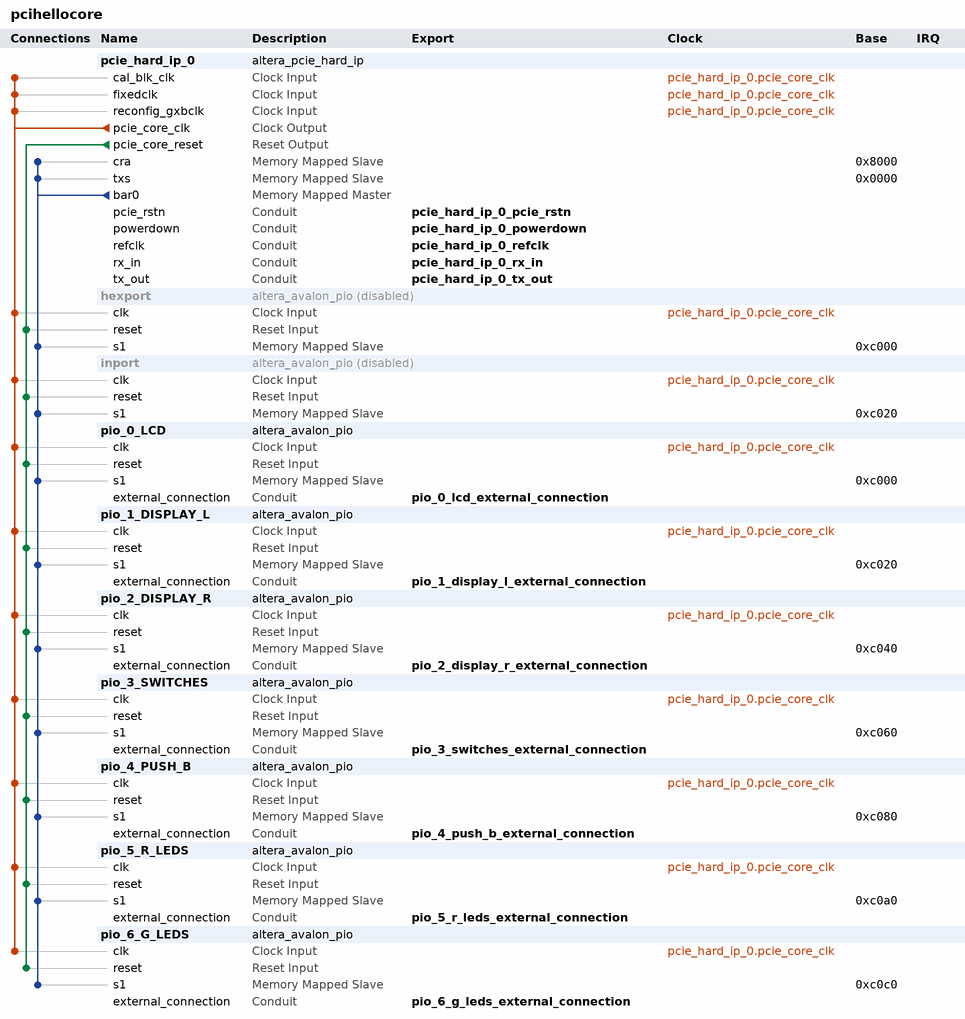
[diagram p0: system contents]
# Platform Designer (Qsys) system pcihellocore, Cyclone IV GX EP4CGX150DF31C7
# Parameters at their usual value, and those the tool derives, are not listed.
package require -exact qsys 17.1
create_system pcihellocore
set_project_property DEVICE_FAMILY {Cyclone IV GX}
set_project_property DEVICE EP4CGX150DF31C7

add_instance pcie_hard_ip_0 altera_pcie_hard_ip 17.1
set_instance_parameter_value pcie_hard_ip_0 {BAR Type} {32 bit Non-Prefetchable,Not used,Not used,Not used,Not used,Not used}
set_instance_parameter_value pcie_hard_ip_0 CB_A2P_ADDR_MAP_PASS_THRU_BITS 15
set_instance_parameter_value pcie_hard_ip_0 CG_ENABLE_A2P_INTERRUPT 0
set_instance_parameter_value pcie_hard_ip_0 CG_NO_CPL_REORDERING 0
set_instance_parameter_value pcie_hard_ip_0 {PCIe Address 31:0} 0x00000000,0x00000000,0x00000000,0x00000000,0x00000000,0x00000000,0x00000000,0x00000000,0x00000000,0x00000000,0x00000000,0x00000000,0x00000000,0x00000000,0x00000000,0x00000000
set_instance_parameter_value pcie_hard_ip_0 {PCIe Address 63:32} 0x00000000,0x00000000,0x00000000,0x00000000,0x00000000,0x00000000,0x00000000,0x00000000,0x00000000,0x00000000,0x00000000,0x00000000,0x00000000,0x00000000,0x00000000,0x00000000
set_instance_parameter_value pcie_hard_ip_0 class_code 0
set_instance_parameter_value pcie_hard_ip_0 device_id 4
set_instance_parameter_value pcie_hard_ip_0 my_advanced_errors false
set_instance_parameter_value pcie_hard_ip_0 my_enable_ecrc_check false
set_instance_parameter_value pcie_hard_ip_0 my_enable_ecrc_gen false
set_instance_parameter_value pcie_hard_ip_0 p_pcie_app_clk 1
set_instance_parameter_value pcie_hard_ip_0 p_pcie_test_out_width None
set_instance_parameter_value pcie_hard_ip_0 p_user_msi_enable 0
set_instance_parameter_value pcie_hard_ip_0 subsystem_device_id 4
set_instance_parameter_value pcie_hard_ip_0 subsystem_vendor_id 4466
set_instance_parameter_value pcie_hard_ip_0 vendor_id 4466

add_instance hexport altera_avalon_pio 17.1
set_instance_property hexport ENABLED false
set_instance_parameter_value hexport direction Output
set_instance_parameter_value hexport width 32

add_instance inport altera_avalon_pio 17.1
set_instance_property inport ENABLED false
set_instance_parameter_value inport direction Input
set_instance_parameter_value inport width 16

add_instance pio_0_LCD altera_avalon_pio 17.1
set_instance_parameter_value pio_0_LCD direction Output
set_instance_parameter_value pio_0_LCD width 32

add_instance pio_1_DISPLAY_L altera_avalon_pio 17.1
set_instance_parameter_value pio_1_DISPLAY_L direction Output
set_instance_parameter_value pio_1_DISPLAY_L width 32

add_instance pio_2_DISPLAY_R altera_avalon_pio 17.1
set_instance_parameter_value pio_2_DISPLAY_R direction Output
set_instance_parameter_value pio_2_DISPLAY_R width 32

add_instance pio_3_SWITCHES altera_avalon_pio 17.1
set_instance_parameter_value pio_3_SWITCHES direction Output
set_instance_parameter_value pio_3_SWITCHES width 32

add_instance pio_4_PUSH_B altera_avalon_pio 17.1
set_instance_parameter_value pio_4_PUSH_B direction Output
set_instance_parameter_value pio_4_PUSH_B width 32

add_instance pio_5_R_LEDS altera_avalon_pio 17.1
set_instance_parameter_value pio_5_R_LEDS direction Output
set_instance_parameter_value pio_5_R_LEDS width 32

add_instance pio_6_G_LEDS altera_avalon_pio 17.1
set_instance_parameter_value pio_6_G_LEDS direction Output
set_instance_parameter_value pio_6_G_LEDS width 32

# connections
add_connection pcie_hard_ip_0.pcie_core_clk hexport.clk clock
add_connection pcie_hard_ip_0.pcie_core_clk inport.clk clock
add_connection pcie_hard_ip_0.pcie_core_clk pcie_hard_ip_0.cal_blk_clk clock
add_connection pcie_hard_ip_0.pcie_core_clk pcie_hard_ip_0.fixedclk clock
add_connection pcie_hard_ip_0.pcie_core_clk pcie_hard_ip_0.reconfig_gxbclk clock
add_connection pcie_hard_ip_0.pcie_core_clk pio_0_LCD.clk clock
add_connection pcie_hard_ip_0.pcie_core_clk pio_1_DISPLAY_L.clk clock
add_connection pcie_hard_ip_0.pcie_core_clk pio_2_DISPLAY_R.clk clock
add_connection pcie_hard_ip_0.pcie_core_clk pio_3_SWITCHES.clk clock
add_connection pcie_hard_ip_0.pcie_core_clk pio_4_PUSH_B.clk clock
add_connection pcie_hard_ip_0.pcie_core_clk pio_5_R_LEDS.clk clock
add_connection pcie_hard_ip_0.pcie_core_clk pio_6_G_LEDS.clk clock
add_connection pcie_hard_ip_0.pcie_core_reset hexport.reset reset
add_connection pcie_hard_ip_0.pcie_core_reset inport.reset reset
add_connection pcie_hard_ip_0.pcie_core_reset pio_0_LCD.reset reset
add_connection pcie_hard_ip_0.pcie_core_reset pio_1_DISPLAY_L.reset reset
add_connection pcie_hard_ip_0.pcie_core_reset pio_2_DISPLAY_R.reset reset
add_connection pcie_hard_ip_0.pcie_core_reset pio_3_SWITCHES.reset reset
add_connection pcie_hard_ip_0.pcie_core_reset pio_4_PUSH_B.reset reset
add_connection pcie_hard_ip_0.pcie_core_reset pio_5_R_LEDS.reset reset
add_connection pcie_hard_ip_0.pcie_core_reset pio_6_G_LEDS.reset reset
add_connection pcie_hard_ip_0.bar0 hexport.s1 avalon
set_connection_parameter_value pcie_hard_ip_0.bar0/hexport.s1 baseAddress 0xc000
add_connection pcie_hard_ip_0.bar0 inport.s1 avalon
set_connection_parameter_value pcie_hard_ip_0.bar0/inport.s1 baseAddress 0xc020
add_connection pcie_hard_ip_0.bar0 pcie_hard_ip_0.cra avalon
set_connection_parameter_value pcie_hard_ip_0.bar0/pcie_hard_ip_0.cra baseAddress 0x8000
add_connection pcie_hard_ip_0.bar0 pcie_hard_ip_0.txs avalon
set_connection_parameter_value pcie_hard_ip_0.bar0/pcie_hard_ip_0.txs baseAddress 0x0000
add_connection pcie_hard_ip_0.bar0 pio_0_LCD.s1 avalon
set_connection_parameter_value pcie_hard_ip_0.bar0/pio_0_LCD.s1 baseAddress 0xc000
add_connection pcie_hard_ip_0.bar0 pio_1_DISPLAY_L.s1 avalon
set_connection_parameter_value pcie_hard_ip_0.bar0/pio_1_DISPLAY_L.s1 baseAddress 0xc020
add_connection pcie_hard_ip_0.bar0 pio_2_DISPLAY_R.s1 avalon
set_connection_parameter_value pcie_hard_ip_0.bar0/pio_2_DISPLAY_R.s1 baseAddress 0xc040
add_connection pcie_hard_ip_0.bar0 pio_3_SWITCHES.s1 avalon
set_connection_parameter_value pcie_hard_ip_0.bar0/pio_3_SWITCHES.s1 baseAddress 0xc060
add_connection pcie_hard_ip_0.bar0 pio_4_PUSH_B.s1 avalon
set_connection_parameter_value pcie_hard_ip_0.bar0/pio_4_PUSH_B.s1 baseAddress 0xc080
add_connection pcie_hard_ip_0.bar0 pio_5_R_LEDS.s1 avalon
set_connection_parameter_value pcie_hard_ip_0.bar0/pio_5_R_LEDS.s1 baseAddress 0xc0a0
add_connection pcie_hard_ip_0.bar0 pio_6_G_LEDS.s1 avalon
set_connection_parameter_value pcie_hard_ip_0.bar0/pio_6_G_LEDS.s1 baseAddress 0xc0c0

# exported interfaces
add_interface pcie_hard_ip_0_pcie_rstn conduit end
set_interface_property pcie_hard_ip_0_pcie_rstn EXPORT_OF pcie_hard_ip_0.pcie_rstn
add_interface pcie_hard_ip_0_powerdown conduit end
set_interface_property pcie_hard_ip_0_powerdown EXPORT_OF pcie_hard_ip_0.powerdown
add_interface pcie_hard_ip_0_refclk conduit end
set_interface_property pcie_hard_ip_0_refclk EXPORT_OF pcie_hard_ip_0.refclk
add_interface pcie_hard_ip_0_rx_in conduit end
set_interface_property pcie_hard_ip_0_rx_in EXPORT_OF pcie_hard_ip_0.rx_in
add_interface pcie_hard_ip_0_tx_out conduit end
set_interface_property pcie_hard_ip_0_tx_out EXPORT_OF pcie_hard_ip_0.tx_out
add_interface pio_0_lcd_external_connection conduit end
set_interface_property pio_0_lcd_external_connection EXPORT_OF pio_0_LCD.external_connection
add_interface pio_1_display_l_external_connection conduit end
set_interface_property pio_1_display_l_external_connection EXPORT_OF pio_1_DISPLAY_L.external_connection
add_interface pio_2_display_r_external_connection conduit end
set_interface_property pio_2_display_r_external_connection EXPORT_OF pio_2_DISPLAY_R.external_connection
add_interface pio_3_switches_external_connection conduit end
set_interface_property pio_3_switches_external_connection EXPORT_OF pio_3_SWITCHES.external_connection
add_interface pio_4_push_b_external_connection conduit end
set_interface_property pio_4_push_b_external_connection EXPORT_OF pio_4_PUSH_B.external_connection
add_interface pio_5_r_leds_external_connection conduit end
set_interface_property pio_5_r_leds_external_connection EXPORT_OF pio_5_R_LEDS.external_connection
add_interface pio_6_g_leds_external_connection conduit end
set_interface_property pio_6_g_leds_external_connection EXPORT_OF pio_6_G_LEDS.external_connection

set_interconnect_requirement {$system} qsys_mm.clockCrossingAdapter HANDSHAKE
set_interconnect_requirement {$system} qsys_mm.maxAdditionalLatency 1

save_system pcihellocore.qsys
